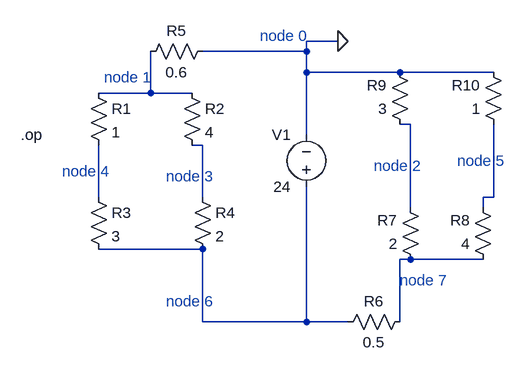
[diagram p0: schematic labeled_equivresistance.asc]
labeled_equivresistance.asc, the LTspice schematic file:
Version 4
SHEET 1 880 680
WIRE 576 64 528 64
WIRE 528 80 528 64
WIRE 528 80 368 80
WIRE 528 112 528 80
WIRE 672 112 528 112
WIRE 816 112 672 112
WIRE 288 144 288 80
WIRE 288 144 208 144
WIRE 352 144 288 144
WIRE 688 192 672 192
WIRE 528 208 528 112
WIRE 368 224 352 224
WIRE 208 304 208 224
WIRE 368 304 368 224
WIRE 816 304 816 192
WIRE 816 304 800 304
WIRE 688 320 688 192
WIRE 800 320 800 304
WIRE 368 384 208 384
WIRE 688 400 672 400
WIRE 800 400 688 400
WIRE 368 496 368 384
WIRE 528 496 528 288
WIRE 528 496 368 496
WIRE 592 496 528 496
WIRE 672 496 672 400
FLAG 576 64 0
SYMBOL res 192 128 R0
SYMATTR InstName R1
SYMATTR Value 1
SYMBOL res 336 128 R0
SYMATTR InstName R2
SYMATTR Value 4
SYMBOL res 192 288 R0
SYMATTR InstName R3
SYMATTR Value 3
SYMBOL res 352 288 R0
SYMATTR InstName R4
SYMATTR Value 2
SYMBOL res 384 64 R90
WINDOW 0 0 56 VBottom 2
WINDOW 3 32 56 VTop 2
SYMATTR InstName R5
SYMATTR Value 0.6
SYMBOL res 688 480 R90
WINDOW 0 0 56 VBottom 2
WINDOW 3 32 56 VTop 2
SYMATTR InstName R6
SYMATTR Value 0.5
SYMBOL res 704 416 R180
WINDOW 0 36 76 Left 2
WINDOW 3 36 40 Left 2
SYMATTR InstName R7
SYMATTR Value 2
SYMBOL res 816 416 R180
WINDOW 0 36 76 Left 2
WINDOW 3 36 40 Left 2
SYMATTR InstName R8
SYMATTR Value 4
SYMBOL res 688 208 R180
WINDOW 0 36 76 Left 2
WINDOW 3 36 40 Left 2
SYMATTR InstName R9
SYMATTR Value 3
SYMBOL res 832 208 R180
WINDOW 0 36 76 Left 2
WINDOW 3 36 40 Left 2
SYMATTR InstName R10
SYMATTR Value 1
SYMBOL voltage 528 304 R180
WINDOW 0 24 96 Left 2
WINDOW 3 24 16 Left 2
SYMATTR InstName V1
SYMATTR Value 24
TEXT 88 208 Left 2 !.op
TEXT 456 56 Left 2 ;node 0
TEXT 216 120 Left 2 ;node 1
TEXT 632 256 Left 2 ;node 2
TEXT 152 264 Left 2 ;node 4
TEXT 312 272 Left 2 ;node 3
TEXT 312 464 Left 2 ;node 6
TEXT 760 248 Left 2 ;node 5
TEXT 672 432 Left 2 ;node 7

The netlist it stands for:
* labeled_equivresistance.asc
R1 N001 N004 1
R2 N001 N003 4
R3 N004 N006 3
R4 N003 N006 2
R5 0 N001 0.6
R6 N007 N006 0.5
R7 N007 N002 2
R8 N007 N005 4
R9 N002 0 3
R10 N005 0 1
V1 N006 0 24
.op
* node 0
* node 1
* node 2
* node 4
* node 3
* node 6
* node 5
* node 7
.backanno
.end